# Altium schematic sheet Power.SchDoc: MoonPilot -  Power
size A3; DrawnBy: Máni Magnússon; Revision: A; SheetNumber: 5
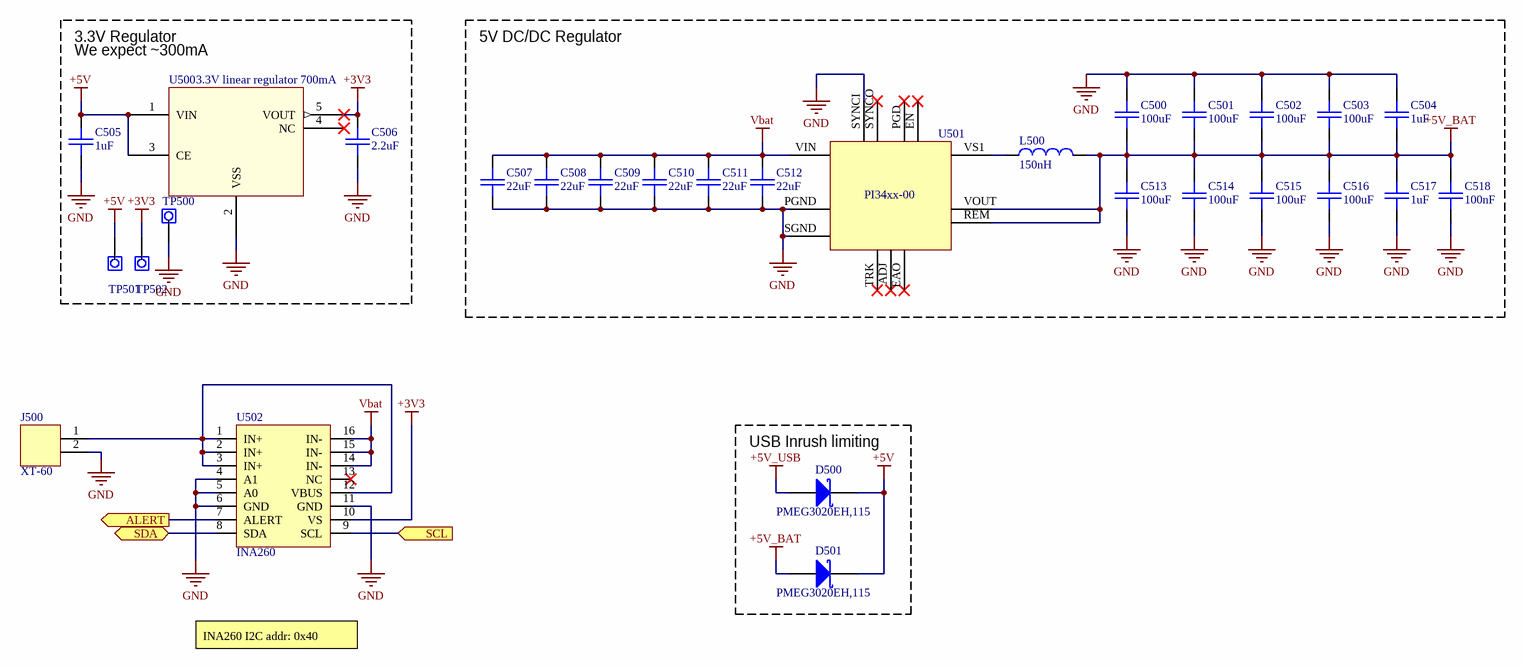
[diagram p0: Power.SchDoc]

## Parts
C500  100uF  [1206_CAP]
C501  100uF  [1206_CAP]
C502  100uF  [1206_CAP]
C503  100uF  [1206_CAP]
C504  1uF  [0805_cap]
C505  1uF  [0603_CAP]
C506  2.2uF  [0603_CAP]
C507  22uF  [1206_CAP]
C508  22uF  [1206_CAP]
C509  22uF  [1206_CAP]
C510  22uF  [1206_CAP]
C511  22uF  [1206_CAP]
C512  22uF  [1206_CAP]
C513  100uF  [1206_CAP]
C514  100uF  [1206_CAP]
C515  100uF  [1206_CAP]
C516  100uF  [1206_CAP]
C517  1uF  [0805_cap]
C518  100nF  [1206_CAP]
D500  PMEG3020EH,115  [SOD-123]
D501  PMEG3020EH,115  [SOD-123]
J500  XT-60  [XT-60]
L500  150nH  [FPV1006-150-R]
TP500  GND  [Testpoint2]  (value not drawn)
TP501  5V  [Testpoint2]  (value not drawn)
TP502  3.3V  [Testpoint2]  (value not drawn)
U500  3.3V linear regulator 700mA  [SOT-25_TOR]
U501  PI34xx-00  [PI34xx-00]
U502  INA260  [TSSOP-16]

## Blocks framed on the sheet
5V DC/DC Regulator: C500-C504 C507-C518 L500 U501
USB Inrush limiting: D500 D501

## Ports
ALERT (out), SCL (in), SDA (bidir)

## Nets
+3V3: C506.1 TP502.1 U500.5(VOUT) U502.10(VS)
+5V: C505.1 D500.2(K) D501.2(K) TP501.1 U500.1(VIN) U500.3(CE)
+5V_BAT: C500.2 C501.2 C502.2 C503.2 C504.2 C513.1 C514.1 C515.1 C516.1 C517.1 C518.1 D501.1(A) L500.2 U501.REM U501.VOUT
+5V_USB: D500.1(A)
GND: C500.1 C501.1 C502.1 C503.1 C504.1 C505.2 C506.2 C507.2 C508.2 C509.2 C510.2 C511.2 C512.2 C513.2 C514.2 C515.2 C516.2 C517.2 C518.2 J500.2 TP500.1 U500.2(VSS) U501.PGND U501.SGND U501.SYNCI U502.4(A1) U502.5(A0) U502.6(GND) U502.11(GND)
Vbat: C507.1 C508.1 C509.1 C510.1 C511.1 C512.1 U501.VIN U502.14(IN-) U502.15(IN-) U502.16(IN-)
ALERT: U502.7(ALERT) ; port ALERT
SCL: U502.9(SCL) ; port SCL
SDA: U502.8(SDA) ; port SDA
NetJ500_1: J500.1 U502.1(IN+) U502.2(IN+) U502.3(IN+) U502.12(VBUS)
NetL500_1: L500.1 U501.VS1

Not connected (* = marked no-connect by the designer): U500 4(NC)*; U501 ADJ* EAO* EN* PGD* SYNCO* TRK*; U502 13(NC)*

## Notes on the sheet
- 3.3V Regulator
- We expect ~300mA
- INA260 I2C addr: 0x40
- Sheet title:
- Revision:
- Drawn by:
- Date:
- File:

## Library data of the parts
C500-C518 = Capacitor
D500 D501 = Schottky diode
J500 = XT-60: Digikey part no. 1568-1816-ND
L500 = Inductor
TP500-TP502 = Testpoint
U500 = XC6222B331MR-G: Digikey part no. 893-1143-1-ND; Vendor: Torex Semiconductor; Built_By: EMA_UL_Team; SourceLibrary: Torex_2016-07-11_1; Manufacturer_Part_Number: XC6222B331MR-G; Copyright: Copyright (C) 2018 Accelerated Designs. All rights reserved; RefDes: RefDes; Type: DEV
U501 = PI34xx-00: Digikey part no. 1102-1641-ND
U502 = INA260: ComponentLink1Description: Datasheet; ComponentLink1URL: https://www.ti.com/lit/ds/symlink/ina260.pdf?ts=1625223015380&ref_url=https%253A%252F%252Fwww.google.com%252F